# EAGLE design autotesterv1 (EAGLE 8.2.2)
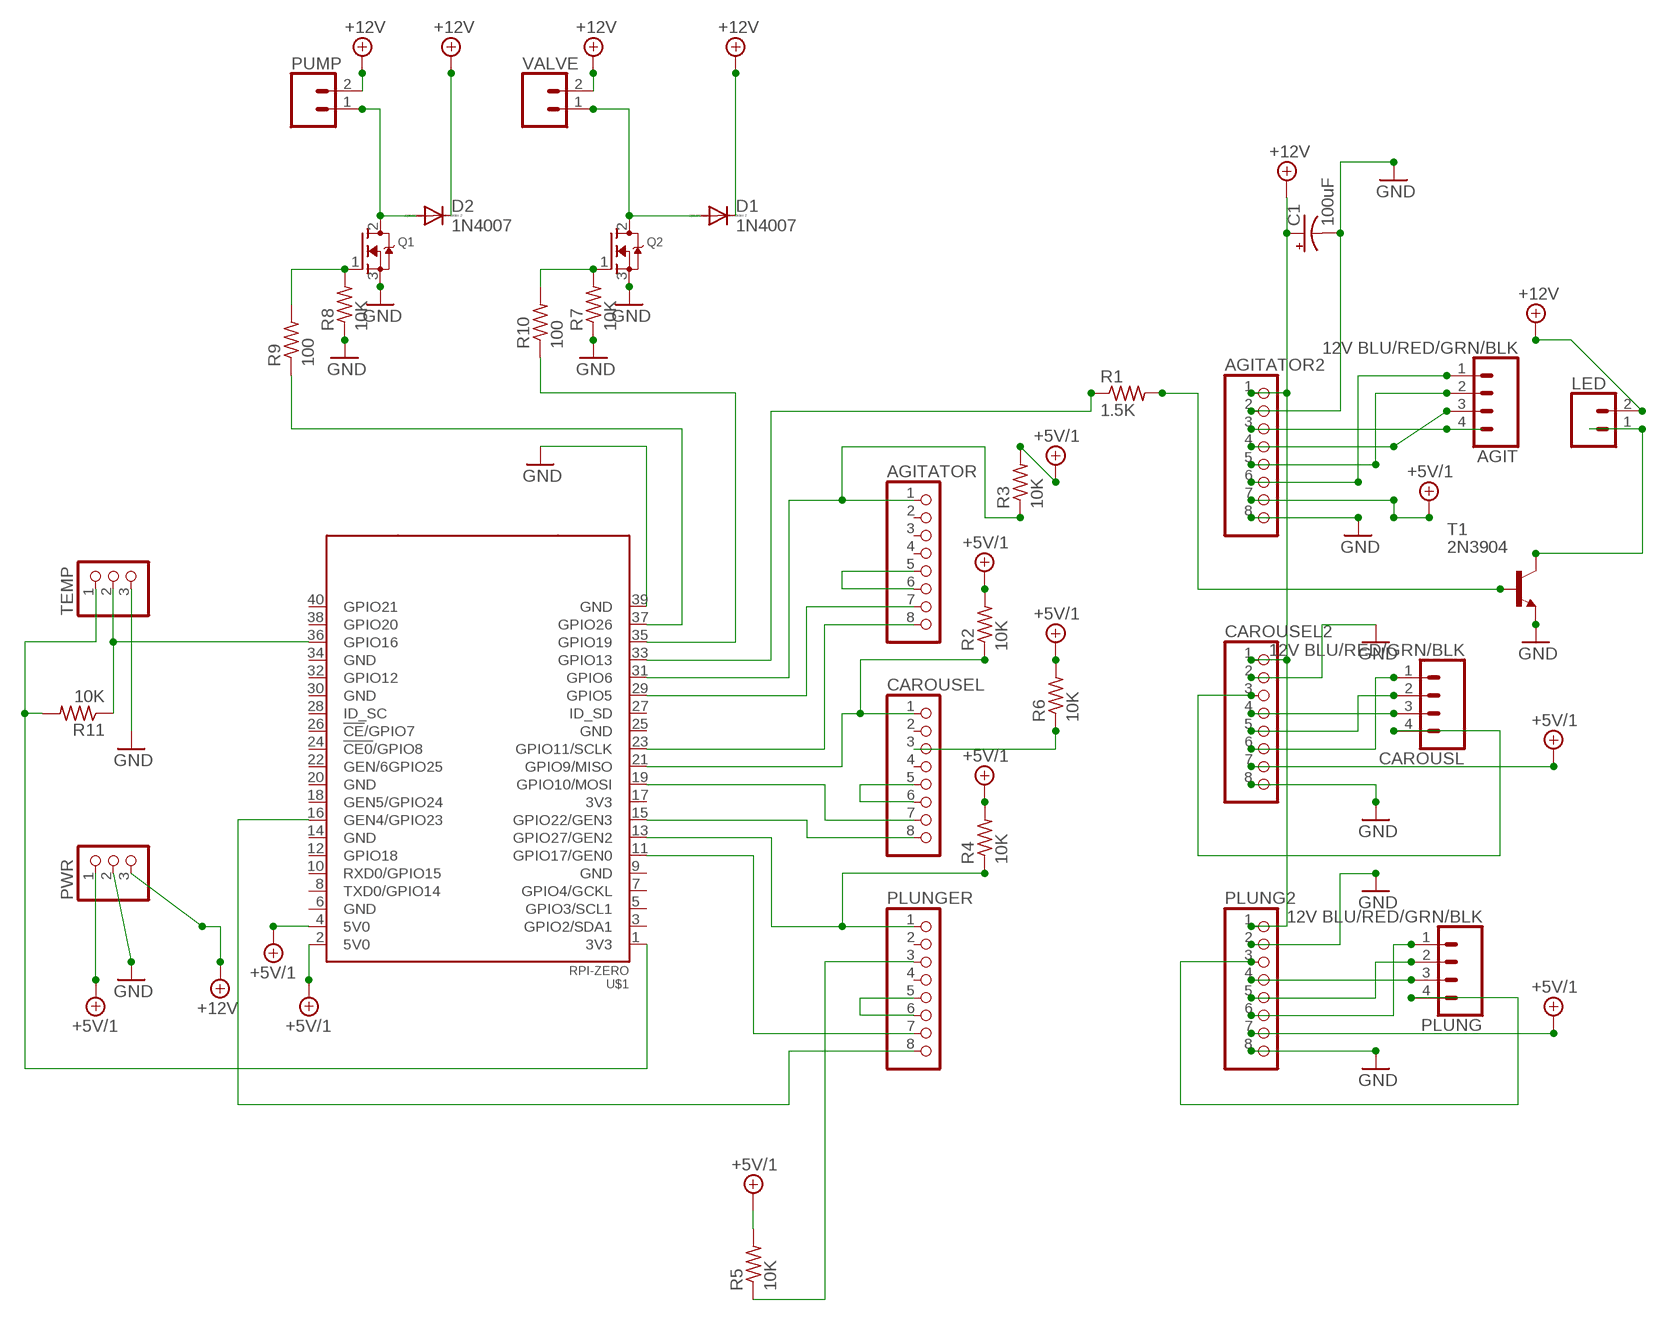
[diagram p0: schematic, sheet 1]

## Parts
AGIT  12V BLU/RED/GRN/BLK  CONN_04SCREW  [SCREWTERMINAL-3.5MM-4]
AGITATOR  PINHD-1X8  [1X08]
AGITATOR2  PINHD-1X8  [1X08]
C1  100uF  1000UF-RADIAL-5MM-25V-20%  [CPOL-RADIAL-5MM-10MM]
CAROUSEL  PINHD-1X8  [1X08]
CAROUSEL2  PINHD-1X8  [1X08]
CAROUSL  12V BLU/RED/GRN/BLK  CONN_04SCREW  [SCREWTERMINAL-3.5MM-4]
D1  1N4007  1N4004  [DO41-10]
D2  1N4007  1N4004  [DO41-10]
LED  CONN_023.5MM  [SCREWTERMINAL-3.5MM-2]
PLUNG  12V BLU/RED/GRN/BLK  CONN_04SCREW  [SCREWTERMINAL-3.5MM-4]
PLUNG2  PINHD-1X8  [1X08]
PLUNGER  PINHD-1X8  [1X08]
PUMP  CONN_023.5MM  [SCREWTERMINAL-3.5MM-2]
PWR  PINHD-1X3  [1X03]
Q1  MOSFET-NGDS_TO220V  [TO220V]
Q2  MOSFET-NGDS_TO220V  [TO220V]
R1  1.5K  R-US_0207/10  [0207/10]
R2  10K  R-US_0207/10  [0207/10]
R3  10K  R-US_0207/10  [0207/10]
R4  10K  R-US_0207/10  [0207/10]
R5  10K  R-US_0207/10  [0207/10]
R6  10K  R-US_0207/10  [0207/10]
R7  10K  R-US_0207/10  [0207/10]
R8  10K  R-US_0207/10  [0207/10]
R9  100  R-US_0207/10  [0207/10]
R10  100  R-US_0207/10  [0207/10]
R11  10K  R-US_0207/10  [0207/10]
T1  2N3904  [TO92]
TEMP  PINHD-1X3  [1X03]
U$1  RPI-ZERO  [RASPBERRYPI_BASTELSTUBE_V13_RASPI_BOARD_B+_FULL]
VALVE  CONN_023.5MM  [SCREWTERMINAL-3.5MM-2]

## Nets
3V3@1: R11.2 TEMP.1 U$1.1(3V3)
+5V/1: AGITATOR2.7 CAROUSEL2.7 PLUNG2.7 PWR.1 R2.2 R3.2 R4.2 R5.2 R6.2 U$1.2(5V0) U$1.4(5V0)
+12V: AGITATOR2.1 C1.+ CAROUSEL2.1 D1.C D2.C LED.2 PLUNG2.1 PUMP.2 PWR.3 VALVE.2
GND: AGITATOR2.2 AGITATOR2.8 C1.- CAROUSEL2.2 CAROUSEL2.8 PLUNG2.2 PLUNG2.8 PWR.2 Q1.3(S) Q2.3(S) R7.1 R8.1 T1.3(E) TEMP.3 U$1.39(GND)
N$1: AGITATOR.1 R3.1 U$1.31(GPIO6)
N$2: PLUNGER.8 U$1.16(GEN4/GPIO23)
N$3: PLUNGER.3 R5.1
N$4: AGIT.3 AGITATOR2.4
N$5: PLUNGER.7 U$1.11(GPIO17/GEN0)
N$6: PLUNGER.1 R4.1 U$1.13(GPIO27/GEN2)
N$7: AGITATOR.8 U$1.23(GPIO11/SCLK)
N$8: CAROUSEL.8 U$1.15(GPIO22/GEN3)
N$9: CAROUSEL.7 U$1.19(GPIO10/MOSI)
N$10: CAROUSEL.1 R2.1 U$1.21(GPIO9/MISO)
N$11: AGIT.2 AGITATOR2.5
N$12: AGIT.1 AGITATOR2.6
N$13: AGITATOR.7 U$1.29(GPIO5)
N$14: PLUNG2.6 PLUNG.1
N$15: PLUNG2.5 PLUNG.2
N$16: CAROUSEL2.6 CAROUSL.1
N$17: R1.1 U$1.33(GPIO13)
N$18: R1.2 T1.2(B)
N$19: AGIT.4 AGITATOR2.3
N$20: LED.1 T1.1(C)
N$21: D2.A PUMP.1 Q1.2(D)
N$22: R9.1 U$1.37(GPIO26)
N$23: CAROUSEL2.5 CAROUSL.2
N$24: CAROUSEL2.4 CAROUSL.3
N$25: CAROUSEL2.3 CAROUSL.4
N$26: PLUNG2.4 PLUNG.3
N$27: PLUNG2.3 PLUNG.4
N$28: Q1.1(G) R8.2 R9.2
N$29: CAROUSEL.3 R6.1
N$30: AGITATOR.5 AGITATOR.6
N$31: CAROUSEL.5 CAROUSEL.6
N$32: PLUNGER.5 PLUNGER.6
N$33: D1.A Q2.2(D) VALVE.1
N$34: R10.1 U$1.35(GPIO19)
N$35: Q2.1(G) R7.2 R10.2
N$36: R11.1 TEMP.2 U$1.36(GPIO16)
Unconnected: AGITATOR.2 AGITATOR.3 AGITATOR.4 CAROUSEL.2 CAROUSEL.4 PLUNGER.2 PLUNGER.4 U$1.3(GPIO2/SDA1) U$1.5(GPIO3/SCL1) U$1.6(GND) U$1.7(GPIO4/GCKL) U$1.8(TXD0/GPIO14) U$1.9(GND) U$1.10(RXD0/GPIO15) U$1.12(GPIO18) U$1.14(GND) U$1.17(3V3) U$1.18(GEN5/GPIO24) U$1.20(GND) U$1.22(GEN/6GPIO25) U$1.24(!CE0!/GPIO8) U$1.25(GND) U$1.26(!CE!/GPIO7) U$1.27(ID_SD) U$1.28(ID_SC) U$1.30(GND) U$1.32(GPIO12) U$1.34(GND) U$1.38(GPIO20) U$1.40(GPIO21)

## Library data of the parts
AGIT CAROUSL PLUNG = SparkFun-Connectors:CONN_04: Multi connection point. Often used as Generic Header-pin footprint for 0.1 inch spaced/style header connections On any of the 0.1 inch spaced packages, you can populate with these: Break Away Headers - Straight <https://www.sparkfun.com/products/116> (PRT-00116) Break Away Male Headers - Right Angle <https://www.sparkfun.com/products/553> (PRT-00553) Female Headers <https://www.sparkfun.com/products/115> (PRT-00115) Break Away Headers - Machine Pin <https://www.sparkfun.com/products/117> (PRT-00117) Break Away Female Headers - Swiss Machine Pin <https://www.sparkfun.com/products/743> (PRT-00743) For SCREWTERMINALS and SPRING TERMINALS visit here: Screw Terimnals on SparkFun.com <https://www.sparkfun.com/search/results?term=Screw+Terminals> (5mm/3.5mm/2.54mm spacing) This device is also useful as a general connection point to wire up your design to another part of your project. Our various solder wires solder well into these plated through hole pads. Hook-Up Wire - Assortment (Stranded, 22 AWG) <https://www.sparkfun.com/products/11375> (PRT-11375) Hook-Up Wire - Assortment (Solid Core, 22 AWG) <https://www.sparkfun.com/products/11367> (PRT-11367) View the entire wire category on our website here <https://www.sparkfun.com/categories/141> Special notes: Molex polarized connector foot print use with SKU : PRT-08231 with associated crimp pins and housings. 1MM SMD Version SKU: PRT-10208; PROD_ID: 2xCONN-08399; SF_ID: 2xPRT-08084
AGITATOR AGITATOR2 CAROUSEL CAROUSEL2 PLUNG2 PLUNGER = pinhead:PINHD-1X8: PIN HEADER
C1 = SparkFun-Capacitors:1000UF: 1,000µF/1mF ceramic capacitors A capacitor is a passive two-terminal electrical component used to store electrical energy temporarily in an electric field. CAP-08070; PROD_ID: CAP-09538; VALUE: 1mF
D1 D2 = diode:1N4004: DIODE general purpose rectifier, 1 A
LED PUMP VALVE = SparkFun-Connectors:CONN_02: Multi connection point. Often used as Generic Header-pin footprint for 0.1 inch spaced/style header connections On any of the 0.1 inch spaced packages, you can populate with these: Break Away Headers - Straight <https://www.sparkfun.com/products/116> (PRT-00116) Break Away Male Headers - Right Angle <https://www.sparkfun.com/products/553> (PRT-00553) Female Headers <https://www.sparkfun.com/products/115> (PRT-00115) Break Away Headers - Machine Pin <https://www.sparkfun.com/products/117> (PRT-00117) Break Away Female Headers - Swiss Machine Pin <https://www.sparkfun.com/products/743> (PRT-00743) For SCREWTERMINALS and SPRING TERMINALS visit here: Screw Terimnals on SparkFun.com <https://www.sparkfun.com/search/results?term=Screw+Terminals> (5mm/3.5mm/2.54mm spacing) This device is also useful as a general connection point to wire up your design to another part of your project. Our various solder wires solder well into these plated through hole pads. Hook-Up Wire - Assortment (Stranded, 22 AWG) <https://www.sparkfun.com/products/11375> (PRT-11375) Hook-Up Wire - Assortment (Solid Core, 22 AWG) <https://www.sparkfun.com/products/11367> (PRT-11367) View the entire wire category on our website here <https://www.sparkfun.com/categories/141> Special notes: Molex polarized connector foot print use with: PRT-08233 with associated crimp pins and housings. 2.54_SCREWTERM for use with PRT-10571. 3.5mm Screw Terminal footprints for PRT-08084 5mm Screw Terminal footprints for use with PRT-08432; PROD_ID: CONN-08399
PWR TEMP = adafruit:PINHD-1X3: PIN HEADER
Q1 Q2 = adafruit:MOSFET-N: N-Channel Mosfet 2N7002E - 60V 260mA SOT23 [Digikey: 2N7002ET1GOSTR-ND] - REEL BSH103 - 30V 850mA SOT23 [Digikey: 568-5013-1-ND]
R1-R11 = rcl:R-US_: RESISTOR, American symbol
T1 = transistor:2N3904: NPN TRANSISTOR
U$1 = RPI-Zero2:RPI-ZERO

## Net classes
0 default: width 0.6 mm, drill 0.254 mm, clearance 0.6 mm
1 power: width 1 mm, drill 0.254 mm, clearance 0.6 mm

## Board
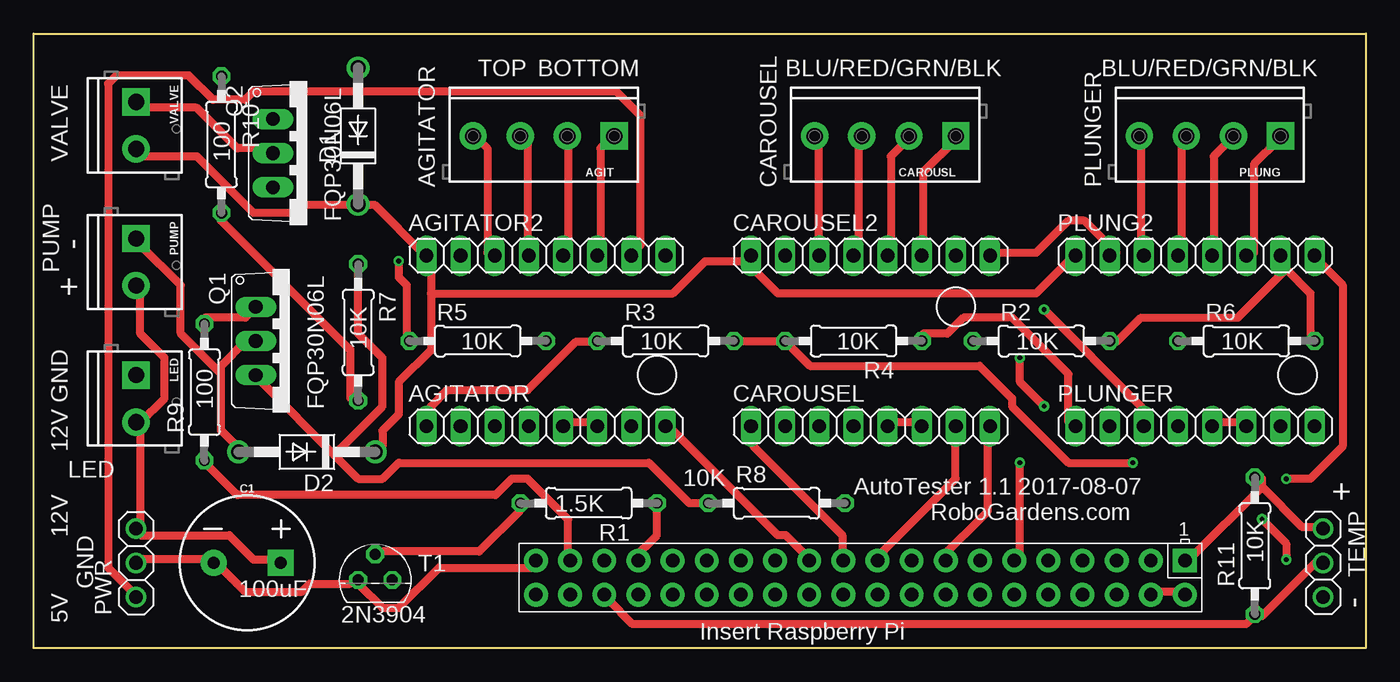
[diagram p1: board, top side]
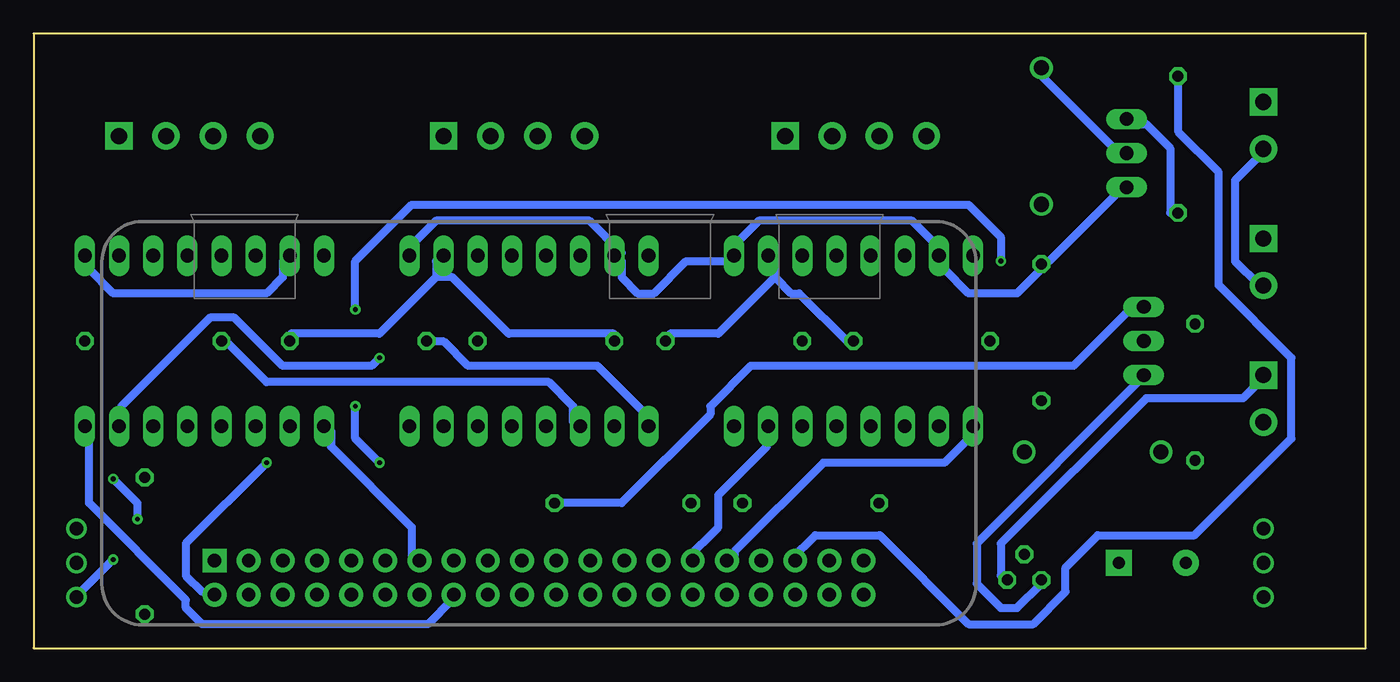
[diagram p2: board, bottom side, seen from below]

Size 99.06 x 45.72 mm. Coordinates in mm from the lower left corner, seen from the top.
Outline: 0,0 0,45.72 99.06,45.72 99.06,0 0,0
Copper layers (1*16): Top 0.035mm / dielectric 1.5mm / Bottom 0.035mm
Design rules "default": minimum track width 6mil, minimum drill 0.35mm, track to track 6mil, track to pad 6mil, pad to pad 6mil, via to via 6mil, smd to smd 6mil, copper to edge 40mil, drill to drill 6mil, minimum pad ring 10mil, minimum via ring 8mil, stop-mask expansion 4mil, vias tented up to drill 0mil, thermal gap 10mil

### Footprints (pad centres in the part's own frame; a part is rotated, then mirrored left to right if it is on the bottom)
SCREWTERMINAL-3.5MM-4 = drill 1.2 pad 2.032 square: 1 0,0 | drill 1.2 pad 2.032: 2 3.5,0; 3 7,0; 4 10.5,0
1X08 = drill 1.016 long: 1 -8.89,0; 2 -6.35,0; 3 -3.81,0; 4 -1.27,0; 5 1.27,0; 6 3.81,0; 7 6.35,0; 8 8.89,0
CPOL-RADIAL-5MM-10MM = drill 0.9 pad 1.93 square: + 2.5,0 | drill 0.9 pad 1.93: - -2.5,0
DO41-10 = drill 1.118: A 5.08,0; C -5.08,0
SCREWTERMINAL-3.5MM-2 = drill 1.2 pad 2.032 square: 1 0,0 | drill 1.2 pad 2.032: 2 3.5,0
1X03 = drill 1.016: 1 -2.54,0; 2 0,0; 3 2.54,0
TO220V = drill 1.016 long: 1 -2.54,-2.54; 2 0,-2.54; 3 2.54,-2.54
0207/10 = drill 0.813 octagon: 1 -5.08,0; 2 5.08,0
TO92 = drill 0.813 octagon: 1 1.27,0; 2 0,1.905; 3 -1.27,0
RASPBERRYPI_BASTELSTUBE_V13_RASPI_BOARD_B+_FULL = drill 1 pad 1.778 square: 1 8.37,25.23 | drill 1 pad 1.778: 2 8.37,27.77; 3 10.91,25.23; 4 10.91,27.77; 5 13.45,25.23; 6 13.45,27.77; 7 15.99,25.23; 8 15.99,27.77; 9 18.53,25.23; 10 18.53,27.77; 11 21.07,25.23; 12 21.07,27.77; 13 23.61,25.23; 14 23.61,27.77; 15 26.15,25.23; 16 26.15,27.77; 17 28.69,25.23; 18 28.69,27.77; 19 31.23,25.23; 20 31.23,27.77; 21 33.77,25.23; 22 33.77,27.77; 23 36.31,25.23; 24 36.31,27.77; 25 38.85,25.23; 26 38.85,27.77; 27 41.39,25.23; 28 41.39,27.77; 29 43.93,25.23; 30 43.93,27.77; 31 46.47,25.23; 32 46.47,27.77; 33 49.01,25.23; 34 49.01,27.77; 35 51.55,25.23; 36 51.55,27.77; 37 54.09,25.23; 38 54.09,27.77; 39 56.63,25.23; 40 56.63,27.77

### Placement (x,y rotation side)
AGIT  43.18,38.1 180 top
AGITATOR  38.1,16.51 0 top
AGITATOR2  38.1,29.21 0 top
C1  15.88,6.35 0 top
CAROUSEL  62.23,16.51 0 top
CAROUSEL2  62.23,29.21 0 top
CAROUSL  68.58,38.1 180 top
D1  24.13,38.1 90 top
D2  20.32,14.61 180 top
LED  7.62,20.32 270 top
PLUNG  92.71,38.1 180 top
PLUNG2  86.36,29.21 0 top
PLUNGER  86.36,16.51 0 top
PUMP  7.62,30.48 270 top
PWR  7.62,6.35 90 top
Q1  19.05,22.86 270 top
Q2  20.32,36.83 270 top
R1  41.27,10.79 180 top
R2  74.93,22.86 0 top
R3  46.99,22.86 0 top
R4  60.96,22.86 180 top
R5  33.02,22.86 0 top
R6  90.17,22.86 0 top
R7  24.13,23.5 270 top
R8  55.24,10.79 0 top
R9  12.7,19.05 90 top
R10  13.97,37.47 270 top
R11  90.81,7.62 90 top
T1  25.4,5.08 0 top
TEMP  95.89,6.35 270 top
U$1  93.98,31.75 180 top
VALVE  7.62,40.64 270 top

### Tracks (layer width: path | path; a pad name or v marks a point on that pad's centre or on a via)
3V3@1
  Top 0.6: 91.34,12 91.34,12.6 R11.2 | 91.34,12 94.34,9 95.54,9 TEMP.1 | 91.34,12 85.94,6.6 U$1.1
+5V/1  (via drill 0.35)
  Top 0.6: 93.14,28.2 92.54,28.8 PLUNG2.7 93.14,28.2 | 93.14,28.2 94.94,26.4 94.94,23.4 R6.2 | 93.14,28.2 89.54,24.6 82.34,24.6 80.54,22.8 R2.2 | U$1.4 83.54,4.2 85.34,4.2 U$1.2 | R3.2 52.34,22.8 55.34,22.8 R4.2 57.74,21 70.34,21 72.74,18.6 72.74,18 76.94,13.8 v81.74,13.8 | PWR.1 7.34,4.2 5.54,6 5.54,42 6.14,42.6 11.54,42.6 13.34,40.8 15.74,40.8 16.34,41.4 43.34,41.4 45.14,39.6 45.14,30 44.54,29.4 AGITATOR2.7
  Bottom 0.6: 69.14,27.6 73.34,23.4 79.94,23.4 R2.2 | 69.14,27.6 69.14,28.8 CAROUSEL2.7 | 43.94,27.6 42.74,26.4 42.14,26.4 38.54,22.8 R5.2 | 43.94,27.6 43.94,28.8 AGITATOR2.7 | 43.94,27.6 48.14,23.4 51.74,23.4 R3.2 | v81.74,13.8 87.74,7.8 87.74,5.4 86.54,4.2 85.94,4.2 U$1.2 | 69.14,27.6 67.94,27.6 63.74,23.4 55.94,23.4 R4.2
+12V
  Top 0.6: PLUNG2.1 76.94,28.8 74.54,26.4 55.34,26.4 53.54,28.2 53.54,28.8 CAROUSEL2.1 52.94,28.8 49.94,28.8 47.54,26.4 29.54,26.4 | 29.54,26.4 29.54,28.8 AGITATOR2.1 28.94,29.4 25.34,33 24.14,33 D1.C 23.54,33 19.94,33 19.34,32.4 16.34,32.4 12.14,36.6 7.94,36.6 VALVE.2 | 29.54,26.4 29.54,22.2 27.14,19.8 27.14,17.4 25.94,16.2 25.94,15 D2.C | 7.94,16.8 7.94,9 PWR.3 7.94,8.4 14.54,8.4 16.34,6.6 18.14,6.6 C1.+ | 7.94,16.8 9.74,18.6 9.74,21.6 7.94,23.4 7.94,26.4 PUMP.2 | 7.94,16.8 LED.2
  Bottom 0.6: PUMP.2 7.94,27 9.74,28.8 9.74,34.8 7.94,36.6 VALVE.2
GND  (via drill 0.35)
  Top 0.6: CAROUSEL2.8 71.54,29.4 74.54,29.4 76.94,31.8 78.14,31.8 80.54,29.4 PLUNG2.2 | v93.14,6.6 93.14,7.8 v91.34,9.6 | v93.14,12.6 94.94,12.6 97.34,15 97.34,27 95.54,28.8 PLUNG2.8 | PWR.2 7.94,6.6 13.34,6.6 C1.- 13.94,6 15.74,4.2 19.94,4.2 20.54,4.8 23.54,4.8 T1.3 24.14,4.8 25.94,3 27.14,3 30.14,6 37.34,6 U$1.39 | 22.34,14.4 16.94,19.8 Q1.3 | 22.34,14.4 24.14,12.6 25.94,12.6 27.14,13.8 45.74,13.8 48.74,10.8 49.94,10.8 R8.1 | 22.34,14.4 25.94,18 25.94,21.6 24.14,23.4 24.14,28.2 R7.1
  Bottom 0.6: PLUNG2.8 94.94,28.8 94.94,28.2 93.14,26.4 81.74,26.4 80.54,27.6 80.54,28.8 PLUNG2.2 | v93.14,6.6 95.54,4.2 TEMP.3 | v91.34,9.6 91.34,10.8 v93.14,12.6 | Q2.3 18.14,34.2 23.54,28.8 R7.1 24.14,28.2 25.94,26.4 29.54,26.4 31.34,28.2 31.34,28.8 AGITATOR2.2 31.34,29.4 33.74,31.8 45.14,31.8 46.94,30 46.94,29.4 AGITATOR2.8 47.54,28.8 50.54,28.8 52.94,26.4 54.14,26.4 55.34,27.6 55.34,28.8 CAROUSEL2.2 55.34,29.4 57.74,31.8 69.14,31.8 70.94,30 70.94,29.4 CAROUSEL2.8 | T1.3 24.14,4.8 25.94,3 27.14,3 28.94,4.8 28.94,7.8 16.94,19.8 Q1.3
N$1
  Top 0.6: R3.1 41.54,22.8 40.34,22.8 36.74,19.2 30.74,19.2 29.54,18 29.54,16.8 AGITATOR.1
  Bottom 0.6: U$1.31 46.94,6.6 46.94,7.2 40.34,13.8 31.34,13.8 28.94,16.2 AGITATOR.1
N$2
  Bottom 0.6: PLUNGER.8 94.94,16.2 94.94,10.8 87.74,3.6 87.74,3 86.54,1.8 69.74,1.8 67.94,3.6 U$1.16
N$3  (via drill 0.35)
  Top 0.6: v27.14,28.8 27.14,27.6 27.74,27 27.74,23.4 R5.1 | v75.14,25.2 82.34,18 82.34,16.8 PLUNGER.3
  Bottom 0.6: v27.14,28.8 27.14,30.6 29.54,33 70.94,33 75.14,28.8 v75.14,25.2
N$4
  Top 0.6: AGITATOR2.4 36.74,29.4 36.74,37.8 AGIT.3
N$5  (via drill 0.35)
  Top 0.6: v73.34,21.6 73.34,19.8 v75.14,18 | v73.34,13.8 73.34,6.6 U$1.11
  Bottom 0.6: v73.34,21.6 73.94,21 80.54,21 84.14,24.6 85.94,24.6 92.54,18 92.54,16.8 PLUNGER.7 | v75.14,18 75.14,15.6 v73.34,13.8
N$6
  Top 0.6: R4.1 66.14,23.4 67.94,23.4 69.14,24.6 72.74,24.6 76.94,20.4 76.94,16.8 PLUNGER.1
  Bottom 0.6: U$1.13 70.94,6.6 70.94,9 76.94,15 76.94,16.2 PLUNGER.1
N$7
  Top 0.6: AGITATOR.8 47.54,16.2 55.34,8.4 55.94,8.4 57.74,6.6 U$1.23
N$8
  Top 0.6: CAROUSEL.8 70.94,16.2 70.94,10.2 67.34,6.6 U$1.15
N$9
  Top 0.6: CAROUSEL.7 68.54,16.2 68.54,12.6 62.54,6.6 U$1.19
N$10
  Top 0.6: U$1.21 60.14,6.6 60.14,8.4 53.54,15 53.54,16.2 CAROUSEL.1
  Bottom 0.6: R2.1 69.74,22.8 68.54,22.8 66.74,21 57.14,21 52.94,16.8 CAROUSEL.1
N$11
  Top 0.6: AGITATOR2.5 39.74,29.4 39.74,37.8 AGIT.2
N$12
  Top 0.6: AGITATOR2.6 42.14,29.4 42.14,37.2 42.74,37.8 AGIT.1
N$13
  Bottom 0.6: AGITATOR.7 44.54,16.2 44.54,15 48.14,11.4 48.14,9 50.54,6.6 U$1.29
N$14
  Top 0.6: PLUNG2.6 90.74,29.4 90.74,36 92.54,37.8 PLUNG.1
N$15
  Top 0.6: PLUNG2.5 87.74,29.4 87.74,36.6 88.94,37.8 PLUNG.2
N$16
  Top 0.6: CAROUSEL2.6 66.14,29.4 66.14,35.4 68.54,37.8 CAROUSL.1
N$17
  Top 0.6: R1.1 46.34,10.2 46.34,8.4 44.54,6.6 U$1.33
N$18
  Top 0.6: T1.2 25.94,7.2 33.14,7.2 36.14,10.2 R1.2
N$19
  Top 0.6: AGITATOR2.3 33.74,29.4 33.74,37.2 33.14,37.8 AGIT.4
N$20
  Bottom 0.6: T1.1 27.14,5.4 27.14,7.8 16.34,18.6 9.14,18.6 7.94,19.8 LED.1
N$21
  Top 0.6: 13.94,20.4 13.94,16.2 15.14,15 D2.A | 13.94,20.4 13.94,21 15.74,22.8 16.34,22.8 Q1.2 | 13.94,20.4 10.94,23.4 10.94,27 7.94,30 PUMP.1
N$22
  Top 0.6: R9.1 12.74,13.8 15.14,11.4 34.34,11.4 35.54,12.6 36.74,12.6 39.74,9.6 39.74,6.6 U$1.37
N$23
  Top 0.6: CAROUSEL2.5 63.74,29.4 63.74,36.6 64.94,37.8 CAROUSL.2
N$24
  Top 0.6: CAROUSEL2.4 61.34,29.4 61.34,37.8 CAROUSL.3
N$25
  Top 0.6: CAROUSEL2.3 58.34,29.4 58.34,37.8 CAROUSL.4
N$26
  Top 0.6: PLUNG2.4 85.34,29.4 85.34,37.8 PLUNG.3
N$27
  Top 0.6: PLUNG2.3 82.34,29.4 82.34,37.8 PLUNG.4
N$28
  Top 0.6: R9.2 12.74,24.6 15.74,24.6 16.34,25.2 Q1.1
  Bottom 0.6: R8.2 60.14,10.8 55.34,10.8 48.74,17.4 48.74,18 45.74,21 21.74,21 16.94,25.8 Q1.1
N$29
  Bottom 0.6: R6.1 84.74,22.8 81.74,19.8 60.74,19.8 58.94,18 58.94,16.8 CAROUSEL.3
N$30
  Top 0.6: AGITATOR.5 39.74,16.8 41.54,16.8 AGITATOR.6
N$31
  Top 0.6: CAROUSEL.5 63.74,16.8 65.54,16.8 CAROUSEL.6
N$32
  Top 0.6: PLUNGER.5 87.74,16.8 90.14,16.8 PLUNGER.6
N$33
  Top 0.6: VALVE.1 7.94,40.2 12.14,40.2 15.14,37.2 17.54,37.2 Q2.2
  Bottom 0.6: Q2.2 18.14,37.2 18.74,37.2 24.14,42.6 D1.A
N$34
  Bottom 0.6: R10.1 13.94,42 13.94,38.4 10.94,35.4 10.94,27 5.54,21.6 5.54,15.6 12.74,8.4 19.94,8.4 22.34,6 22.34,4.2 24.74,1.8 29.54,1.8 36.14,8.4 40.94,8.4 42.74,6.6 U$1.35
N$35
  Top 0.6: R7.2 23.54,18.6 23.54,22.2 13.94,31.8 R10.2
  Bottom 0.6: R10.2 14.54,32.4 14.54,37.2 16.34,39 17.54,39 Q2.1
N$36
  Top 0.6: TEMP.2 95.54,6.6 91.34,2.4 R11.1 90.74,2.4 90.14,1.8 44.54,1.8 42.74,3.6 U$1.36

### Text on the board
tPlace: TOP | BOTTOM | BLU/RED/GRN/BLK | BLU/RED/GRN/BLK | VALVE | 100 | AGITATOR | CAROUSEL | PLUNGER | FQP30N06L | - | PUMP | + | 10K | 10K | 10K | 10K | 10K | 10K | 100 | FQP30N06L | 12V GND | LED | 10K | AutoTester 1.1 2017-08-07 | + | 1.5K | RoboGardens.com | 12V | 10K | GND | 100uF | - | 5V | 2N3904 | Insert Raspberry Pi